# EAGLE design StairLights_screw (EAGLE 9.4.2)
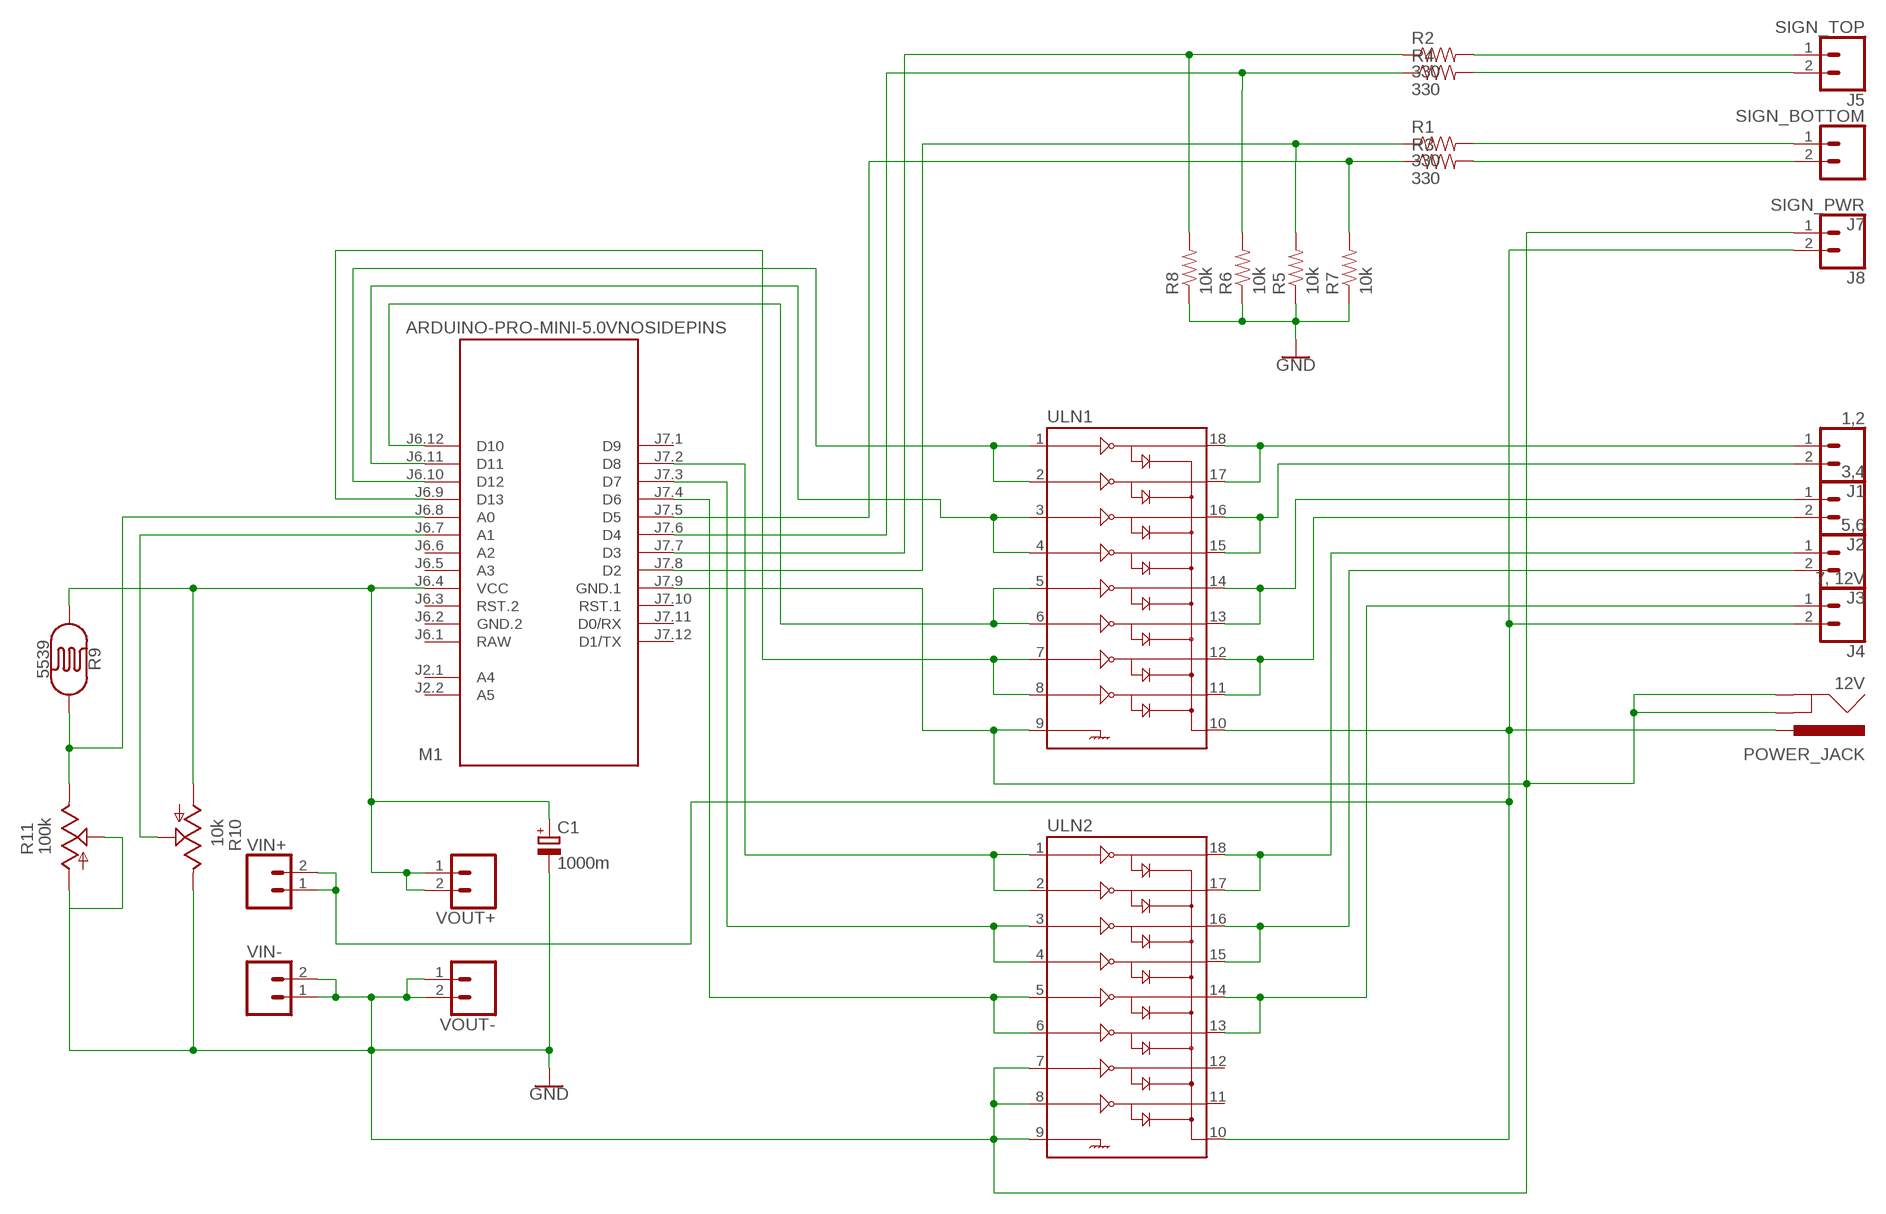
[diagram p0: schematic, sheet 1]

## Parts
12V  POWER_JACK  [POWER_JACK_PTH]
C1  1000m  CPOL-EUE5-5  [E5-5]
J1  1,2  CONN_025MM  [SCREWTERMINAL-5MM-2]
J2  3,4  CONN_025MM  [SCREWTERMINAL-5MM-2]
J3  5,6  CONN_025MM  [SCREWTERMINAL-5MM-2]
J4  7, 12V  CONN_025MM  [SCREWTERMINAL-5MM-2]
J5  SIGN_TOP  CONN_025MM  [SCREWTERMINAL-5MM-2]
J7  SIGN_BOTTOM  CONN_025MM  [SCREWTERMINAL-5MM-2]
J8  SIGN_PWR  CONN_025MM  [SCREWTERMINAL-5MM-2]
M1  ARDUINO-PRO-MINI-5.0VNOSIDEPINS  [ARDUINO-PRO-MINI]
R1  330  330OHM-HORIZ-1/10W-5%  [AXIAL-0.3]
R2  330  330OHM-HORIZ-1/10W-5%  [AXIAL-0.3]
R3  330  330OHM-HORIZ-1/10W-5%  [AXIAL-0.3]
R4  330  330OHM-HORIZ-1/10W-5%  [AXIAL-0.3]
R5  10k  330OHM-HORIZ-1/10W-5%  [AXIAL-0.3]
R6  10k  330OHM-HORIZ-1/10W-5%  [AXIAL-0.3]
R7  10k  330OHM-HORIZ-1/10W-5%  [AXIAL-0.3]
R8  10k  330OHM-HORIZ-1/10W-5%  [AXIAL-0.3]
R9  5539  PHOTOCELLPTH  [PHOTOCELL]
R10  10k  TRIM_US-S64W  [S64W]
R11  100k  TRIM_US-S64W  [S64W]
ULN1  ULN2803DIP  [DIL18]
ULN2  ULN2803DIP  [DIL18]
VIN+  CONN_02  [1X02]
VIN-  CONN_02  [1X02]
VOUT+  CONN_02  [1X02]
VOUT-  CONN_02  [1X02]

## Nets
GND: 12V.GND 12V.GNDBREAK C1.- J8.1 M1.J7.9(GND.1) R5.P$1 R6.P$1 R7.P$1 R8.P$1 R10.E R11.A R11.S ULN1.9 ULN2.7 ULN2.8 ULN2.9 VIN-.1 VIN-.2 VOUT-.1 VOUT-.2
N$1: J1.1 ULN1.17 ULN1.18
N$2: J1.2 ULN1.15 ULN1.16
N$3: M1.J7.7(D3) R2.P$1 R8.P$2
N$4: J2.1 ULN1.13 ULN1.14
N$5: M1.J6.12(D10) ULN1.5 ULN1.6
N$6: J2.2 ULN1.11 ULN1.12
N$7: M1.J6.8(A0) R9.2 R11.E
N$8: J3.1 ULN2.17 ULN2.18
N$9: J3.2 ULN2.15 ULN2.16
N$10: M1.J6.10(D12) ULN1.1 ULN1.2
N$11: J4.1 ULN2.13 ULN2.14
N$12: M1.J7.8(D2) R1.P$1 R5.P$2
N$13: M1.J7.3(D7) ULN2.3 ULN2.4
N$14: M1.J7.4(D6) ULN2.5 ULN2.6
N$15: M1.J6.7(A1) R10.S
N$16: 12V.PWR J4.2 J8.2 ULN1.10 ULN2.10 VIN+.1 VIN+.2
N$17: C1.+ M1.J6.4(VCC) R9.1 R10.A VOUT+.1 VOUT+.2
N$19: M1.J7.2(D8) ULN2.1 ULN2.2
N$20: M1.J7.6(D4) R4.P$1 R6.P$2
N$22: M1.J7.5(D5) R3.P$1 R7.P$2
N$23: J7.1 R1.P$2
N$25: J7.2 R3.P$2
N$26: M1.J6.9(D13) ULN1.7 ULN1.8
N$27: J5.2 R4.P$2
N$28: J5.1 R2.P$2
N$29: M1.J6.11(D11) ULN1.3 ULN1.4
Unconnected: M1.J2.1(A4) M1.J2.2(A5) M1.J6.3(RST.2) M1.J6.5(A3) M1.J6.6(A2) M1.J7.1(D9) M1.J7.10(RST.1) M1.J7.11(D0/RX) M1.J7.12(D1/TX) ULN2.11 ULN2.12

## Power pins joined to a net without a drawn wire
GND.2: M1.J6.2(GND.2)
RAW: M1.J6.1(RAW)

## Library data of the parts
12V = SparkFun-Connectors:POWER_JACK: Power Jack Connector This is the standard 5.5mm barrel jack for power. The PTH is the most common, proven, reliable, footprint. The Slot footprint only works if the mill layer is transmitted to the PCB fab house so be warned. Here are the connectors we sell at SparkFun: DC Barrel Power Jack/Connector <https://www.sparkfun.com/products/119> (PRT-00119) DC Barrel Power Jack/Connector (SMD) <https://www.sparkfun.com/products/12748> (PRT-12748) DC Barrel Jack Adapter - Breadboard Compatible <https://www.sparkfun.com/products/10811> (PRT-10811) It is used on this SparkFun product (and many, many others): SparkFun RedBoard - Programmed with Arduino <https://www.sparkfun.com/products/12757> (DEV-12757) Also, if you need a mating power supply or connector, please check these out: Wall Adapter Power Supply - 9VDC 650mA <https://www.sparkfun.com/products/298> (TOL-00298) DC Barrel Jack Adapter - Male <https://www.sparkfun.com/products/10287> (PRT-10287); PROD_ID: CONN-08197
C1 = resistor:CPOL-EU: POLARIZED CAPACITOR, European symbol
J1-J5 J7 J8 = SparkFun-Connectors:CONN_02: Multi connection point. Often used as Generic Header-pin footprint for 0.1 inch spaced/style header connections On any of the 0.1 inch spaced packages, you can populate with these: Break Away Headers - Straight <https://www.sparkfun.com/products/116> (PRT-00116) Break Away Male Headers - Right Angle <https://www.sparkfun.com/products/553> (PRT-00553) Female Headers <https://www.sparkfun.com/products/115> (PRT-00115) Break Away Headers - Machine Pin <https://www.sparkfun.com/products/117> (PRT-00117) Break Away Female Headers - Swiss Machine Pin <https://www.sparkfun.com/products/743> (PRT-00743) For SCREWTERMINALS and SPRING TERMINALS visit here: Screw Terimnals on SparkFun.com <https://www.sparkfun.com/search/results?term=Screw+Terminals> (5mm/3.5mm/2.54mm spacing) This device is also useful as a general connection point to wire up your design to another part of your project. Our various solder wires solder well into these plated through hole pads. Hook-Up Wire - Assortment (Stranded, 22 AWG) <https://www.sparkfun.com/products/11375> (PRT-11375) Hook-Up Wire - Assortment (Solid Core, 22 AWG) <https://www.sparkfun.com/products/11367> (PRT-11367) View the entire wire category on our website here <https://www.sparkfun.com/categories/141> Special notes: Molex polarized connector foot print use with: PRT-08233 with associated crimp pins and housings. 2.54_SCREWTERM for use with PRT-10571. 3.5mm Screw Terminal footprints for PRT-08084 5mm Screw Terminal footprints for use with PRT-08432; SF_SKU: PRT-08432
M1 = diy-modules:ARDUINO-PRO-MINI-*: Arduino Pro Mini and compatible devices More details available here: https://www.arduino.cc/en/Main/ArduinoBoardProMini Click here to find device on ebay.com <http://www.ebay.com/sch/arduino+pro+mini>
R1-R4 = SparkFun-Resistors:330OHM: 330Ω resistor A resistor is a passive two-terminal electrical component that implements electrical resistance as a circuit element. Resistors act to reduce current flow, and, at the same time, act to lower voltage levels within circuits. - Wikipedia; PROD_ID: RES-8371
R5-R8 = SparkFun-Resistors:330OHM: 330Ω resistor A resistor is a passive two-terminal electrical component that implements electrical resistance as a circuit element. Resistors act to reduce current flow, and, at the same time, act to lower voltage levels within circuits. - Wikipedia; PROD_ID: RES-8371; VALUE: 330
R9 = SparkFun-Sensors:PHOTOCELL: Photocell (Photodetector, Photo Resistor, CdS) This is a very small light sensor. A photocell changes (also called a photodetector, photo resistor, CdS or photoconductive cell) resistance depending on the amount of light it is exposed to. These little sensors make great ambient light triggers (when light in the room turns on, do something). Datasheet <http://cdn.sparkfun.com/datasheets/Sensors/LightImaging/SEN-09088.pdf> SparkFun Products Mini Photocell <https://www.sparkfun.com/products/9088> (SEN-09088); PROD_ID: COMP-09129; SF_ID: SEN-09088
R10 R11 = pot:TRIM_US-: POTENTIOMETER
ULN1 ULN2 = SparkFun-IC-Special-Function:ULN2803: Darlington Driver(IC-07959, low stock) ULN2803 Darlington array. 500mA max per channel, 8-channel package. Spark Fun Electronics SKU : COM-00312
VIN+ VIN- VOUT+ VOUT- = SparkFun-Connectors:CONN_02: Multi connection point. Often used as Generic Header-pin footprint for 0.1 inch spaced/style header connections On any of the 0.1 inch spaced packages, you can populate with these: Break Away Headers - Straight <https://www.sparkfun.com/products/116> (PRT-00116) Break Away Male Headers - Right Angle <https://www.sparkfun.com/products/553> (PRT-00553) Female Headers <https://www.sparkfun.com/products/115> (PRT-00115) Break Away Headers - Machine Pin <https://www.sparkfun.com/products/117> (PRT-00117) Break Away Female Headers - Swiss Machine Pin <https://www.sparkfun.com/products/743> (PRT-00743) For SCREWTERMINALS and SPRING TERMINALS visit here: Screw Terimnals on SparkFun.com <https://www.sparkfun.com/search/results?term=Screw+Terminals> (5mm/3.5mm/2.54mm spacing) This device is also useful as a general connection point to wire up your design to another part of your project. Our various solder wires solder well into these plated through hole pads. Hook-Up Wire - Assortment (Stranded, 22 AWG) <https://www.sparkfun.com/products/11375> (PRT-11375) Hook-Up Wire - Assortment (Solid Core, 22 AWG) <https://www.sparkfun.com/products/11367> (PRT-11367) View the entire wire category on our website here <https://www.sparkfun.com/categories/141> Special notes: Molex polarized connector foot print use with: PRT-08233 with associated crimp pins and housings. 2.54_SCREWTERM for use with PRT-10571. 3.5mm Screw Terminal footprints for PRT-08084 5mm Screw Terminal footprints for use with PRT-08432

## Board
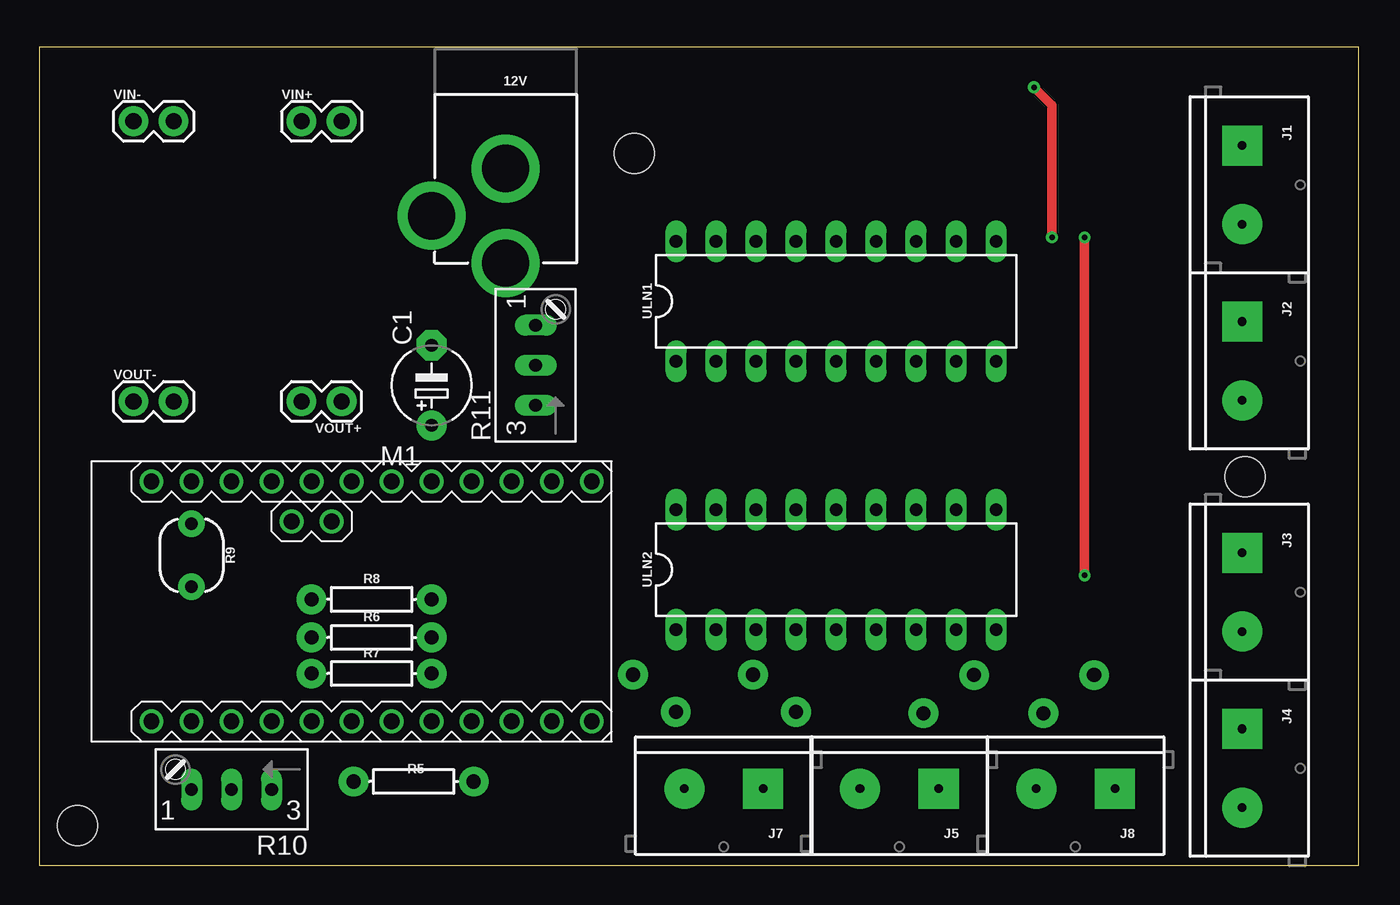
[diagram p1: board, top side]
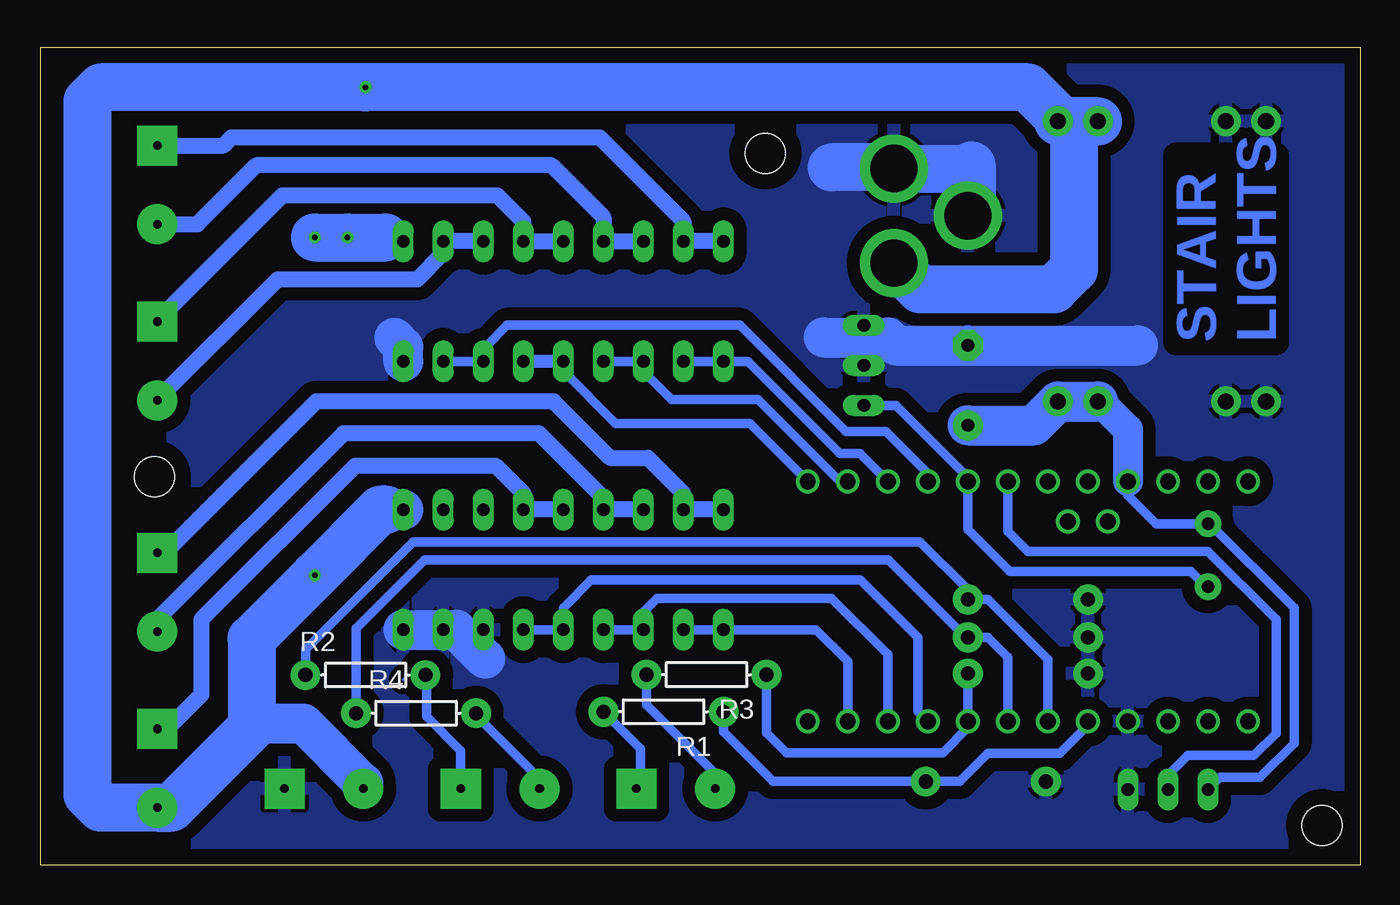
[diagram p2: board, bottom side, seen from below]

Size 83.74 x 51.93 mm. Coordinates in mm from the lower left corner, seen from the top.
Outline: 0,0 83.74,0 83.74,51.93 0,51.93 0,0
Copper layers (1*16): Top 0.035mm / dielectric 1.5mm / Bottom 0.035mm
Design rules "default": minimum track width 6mil, minimum drill 0.35mm, track to track 6mil, track to pad 6mil, pad to pad 6mil, via to via 6mil, smd to smd 6mil, copper to edge 40mil, drill to drill 6mil, minimum pad ring 10mil, minimum via ring 8mil, stop-mask expansion 4mil, vias tented up to drill 0mil, thermal gap 10mil
Holes 2.54 mm at 2.41,2.54 76.5,24.68 37.74,45.2

### Footprints (pad centres in the part's own frame; a part is rotated, then mirrored left to right if it is on the bottom)
POWER_JACK_PTH = drill 2.997 pad 4.318: GND 0,7.7; GNDBREAK 4.7,10.7; PWR 0,13.7
E5-5 = drill 0.813 pad 1.905: + -2.54,0 | drill 0.813 pad 1.905 octagon: - 2.54,0
SCREWTERMINAL-5MM-2 = drill 0.55 pad 2.54 square: 1 0,0 | drill 0.55 pad 2.54: 2 5,0
ARDUINO-PRO-MINI = drill 1: J2.1 -1.27,5.08; J2.2 -3.81,5.08; J6.1 -12.7,7.62; J6.2 -10.16,7.62; J6.3 -7.62,7.62; J6.4 -5.08,7.62; J6.5 -2.54,7.62; J6.6 0,7.62; J6.7 2.54,7.62; J6.8 5.08,7.62; J6.9 7.62,7.62; J6.10 10.16,7.62; J6.11 12.7,7.62; J6.12 15.24,7.62; J7.1 15.24,-7.62; J7.2 12.7,-7.62; J7.3 10.16,-7.62; J7.4 7.62,-7.62; J7.5 5.08,-7.62; J7.6 2.54,-7.62; J7.7 0,-7.62; J7.8 -2.54,-7.62; J7.9 -5.08,-7.62; J7.10 -7.62,-7.62; J7.11 -10.16,-7.62; J7.12 -12.7,-7.62
AXIAL-0.3 = drill 0.9 pad 1.88: P$1 -3.81,0; P$2 3.81,0
PHOTOCELL = drill 0.8 pad 1.676: 1 -2,0; 2 2,0
S64W = drill 0.813 long: A 2.54,1.27; E -2.54,1.27; S 0,1.27
DIL18 = drill 0.813 long: 1 -10.16,-3.81; 2 -7.62,-3.81; 3 -5.08,-3.81; 4 -2.54,-3.81; 5 0,-3.81; 6 2.54,-3.81; 7 5.08,-3.81; 8 7.62,-3.81; 9 10.16,-3.81; 10 10.16,3.81; 11 7.62,3.81; 12 5.08,3.81; 13 2.54,3.81; 14 0,3.81; 15 -2.54,3.81; 16 -5.08,3.81; 17 -7.62,3.81; 18 -10.16,3.81
1X02 = drill 1.016 pad 1.88: 1 0,0; 2 2.54,0

### Placement (x,y rotation side)
12V  29.59,51.94 180 top
C1  24.89,30.48 90 top
J1  76.33,45.7 270 top
J2  76.33,34.53 270 top
J3  76.33,19.85 270 top
J4  76.33,8.68 270 top
J5  57.07,4.88 180 top
J7  45.93,4.88 180 top
J8  68.26,4.88 180 top
M1  19.81,16.76 0 top
R1  44.21,9.76 180 bottom
R2  63.12,12.09 0 bottom
R3  41.48,12.12 180 bottom
R4  59.91,9.67 0 bottom
R5  23.75,5.33 0 top
R6  21.08,14.48 0 top
R7  21.08,12.19 0 top
R8  21.08,16.89 0 top
R9  9.65,19.69 270 top
R10  12.19,6.1 180 top
R11  32.77,31.75 90 top
ULN1  50.56,35.81 0 top
ULN2  50.56,18.78 0 top
VIN+  16.64,47.24 0 top
VIN-  5.97,47.24 0 top
VOUT+  19.18,29.46 180 top
VOUT-  5.97,29.46 0 top

### Tracks (layer width: path | path; a pad name or v marks a point on that pad's centre or on a via)
GND
  Bottom 2.54: 14.1,33.02 C1.- 29.46,33.02 29.97,33.53 34.04,33.53 | ULN2.9 ULN2.8 57.37,14.97 55.53,13.13 | ULN1.9 60.72,32.92 61.3,33.5
  Bottom 3.048: 12V.GNDBREAK 24.64,41.5 24.64,44.45 24.84,44.24 12V.GND 29.67,44.32 33.53,44.32
  pour Bottom (isolate 0.813): -0.64,52.07 84.07,52.07 84.07,-0.25 -0.51,-0.25 -0.64,-0.38
N$1
  Bottom 1.016: ULN1.18 ULN1.17 42.94,40.9 48.26,46.22 71.62,46.22 72.14,45.7 J1.1
N$2
  Bottom 1.016: ULN1.16 ULN1.15 48.02,41.15 51.32,44.44 70.05,44.44 73.79,40.7 J1.2
N$3
  Bottom 0.61: M1.J7.7 19.81,13.08 23.62,16.89 R8.P$2 24.89,17.53 27.92,20.55 60.11,20.55 66.93,13.73 R2.P$1
N$4
  Bottom 1.016: ULN1.14 ULN1.13 53.1,40.88 54.76,42.54 68.39,42.54 76.33,34.6 J2.1
N$5
  Bottom 0.61: ULN1.5 50.56,31.39 47.24,28.07 38.73,28.07 M1.J6.12
  Bottom 0.813: ULN1.5 ULN1.6
N$6
  Bottom 1.016: ULN1.12 ULN1.11 58.18,38.87 59.84,37.21 68.69,37.21 76.33,29.57 J2.2
N$7
  Bottom 0.61: R11.E 29.46,29.21 24.89,24.64 M1.J6.8 24.89,21.34 22.23,18.67 10.76,18.67 9.78,17.69 R9.2
N$8
  Bottom 1.016: ULN2.18 ULN2.17 42.94,23.61 45.2,25.87 47.59,25.87 51.18,29.46 66.24,29.46 75.86,19.85 J3.1
N$9
  Bottom 1.016: ULN2.16 ULN2.15 48.02,23.33 52.12,27.43 64.51,27.43 76.33,15.61 J3.2
N$10
  Bottom 0.61: ULN1.2 ULN1.1 38.86,32 33.02,26.16 31.75,26.16 M1.J6.10
N$11
  Bottom 1.016: ULN2.14 ULN2.13 53.1,23.62 54.87,25.39 63.76,25.39 73.53,15.61 73.53,10.84 75.69,8.68 J4.1
N$12
  Bottom 0.61: M1.J7.8 17.27,8.89 19.05,7.11 23.62,7.11 25.4,5.33 R5.P$2 37.25,5.33 40.4,8.48 R1.P$1
N$13
  Bottom 0.61: ULN2.4 ULN2.3 45.48,16.11 44.62,16.97 33.54,16.97 29.97,13.4 M1.J7.3
N$14
  Bottom 0.61: ULN2.6 ULN2.5 50.56,16.37 48.8,18.13 31.72,18.13 28.07,14.48 28.07,9.78 M1.J7.4
N$15
  Bottom 0.61: M1.J6.7 22.35,21.21 21.08,19.94 9.65,19.94 5.33,15.62 5.33,8.38 6.73,6.99 10.92,6.99 12.19,5.71 R10.S
N$16  (via drill 0.35)
  Top 0.61: v66.33,39.87 v66.33,18.42 | v63.12,49.39 64.26,48.25 v64.26,39.87
  Bottom 0.152: ULN1.10 60.97,39.87 61.86,39.87
  Bottom 1.27: 61.24,39.87 60.97,39.87
  Bottom 1.905: 18.16,46.23 VIN+.2
  Bottom 2.54: 19.18,47.5 VIN+.2 | ULN2.10 61.78,22.59 | J8.2 63.26,5.22 67.06,9.02 70.1,9.02
  Bottom 3.048: 19.18,47.5 21.07,49.39 v63.12,49.39 79.89,49.39 80.77,48.52 80.77,4.5 79.94,3.68 J4.2 75.44,3.68 70.36,8.76 | VIN+.1 VIN+.2 | 12V.PWR 27.92,36.58 19.43,36.58 18.16,37.85 18.16,46.23 | 70.36,8.76 70.1,9.02 | 61.78,22.59 62.16,22.59 v66.33,18.42 70.36,14.39 70.36,8.76 | v66.33,39.87 v64.26,39.87 61.86,39.87 61.85,39.88
N$17
  Bottom 0.61: M1.J6.4 14.73,23.5 12.93,21.69 R9.1 9.53,21.69 4.19,16.36 4.19,7.75 6.35,5.59 8.89,5.59 R10.A
  Bottom 1.905: M1.J6.4 14.73,27.69 16.51,29.46 VOUT+.2
  Bottom 2.54: VOUT+.2 VOUT+.1 20.7,27.94 C1.+
N$19
  Bottom 0.61: ULN2.2 ULN2.1 34.53,14.97 32.51,12.95 M1.J7.2
N$20
  Bottom 0.61: 22.35,10.29 M1.J7.6 22.35,13.21 23.62,14.48 R6.P$2 25.02,14.48 29.95,19.41 59.37,19.41 63.72,15.05 R4.P$1
N$22
  Bottom 0.61: R3.P$1 37.67,8.43 36.4,7.16 26.49,7.16 24.89,8.76 M1.J7.5 R7.P$2
N$23
  Bottom 0.61: R1.P$2 45.68,7.42 45.68,5.14 J7.1
N$24
  Bottom 0.203: 60.58,11.94 60.71,11.81
N$25
  Bottom 0.61: R3.P$2 45.29,10.21 40.93,5.86 J7.2
N$26
  Bottom 0.61: ULN1.8 ULN1.7 55.39,32.26 55.39,33.02 54.12,34.29 39.37,34.29 32.64,27.56 30.1,27.56 27.43,24.89 M1.J6.9
N$27
  Bottom 0.61: R4.P$2 56.1,9.54 52.07,5.51 J5.2
N$28
  Bottom 0.61: R2.P$2 59.23,12.01 59.23,9.45 57.07,7.29 J5.1
N$29
  Bottom 0.61: ULN1.4 ULN1.3 45.48,31.37 43.7,29.59 38.23,29.59 33.02,24.38 M1.J6.11

### Text on the board
Bottom: STAIR / LIGHTS